# EAGLE design bluz_v2 (EAGLE 7.3.0)
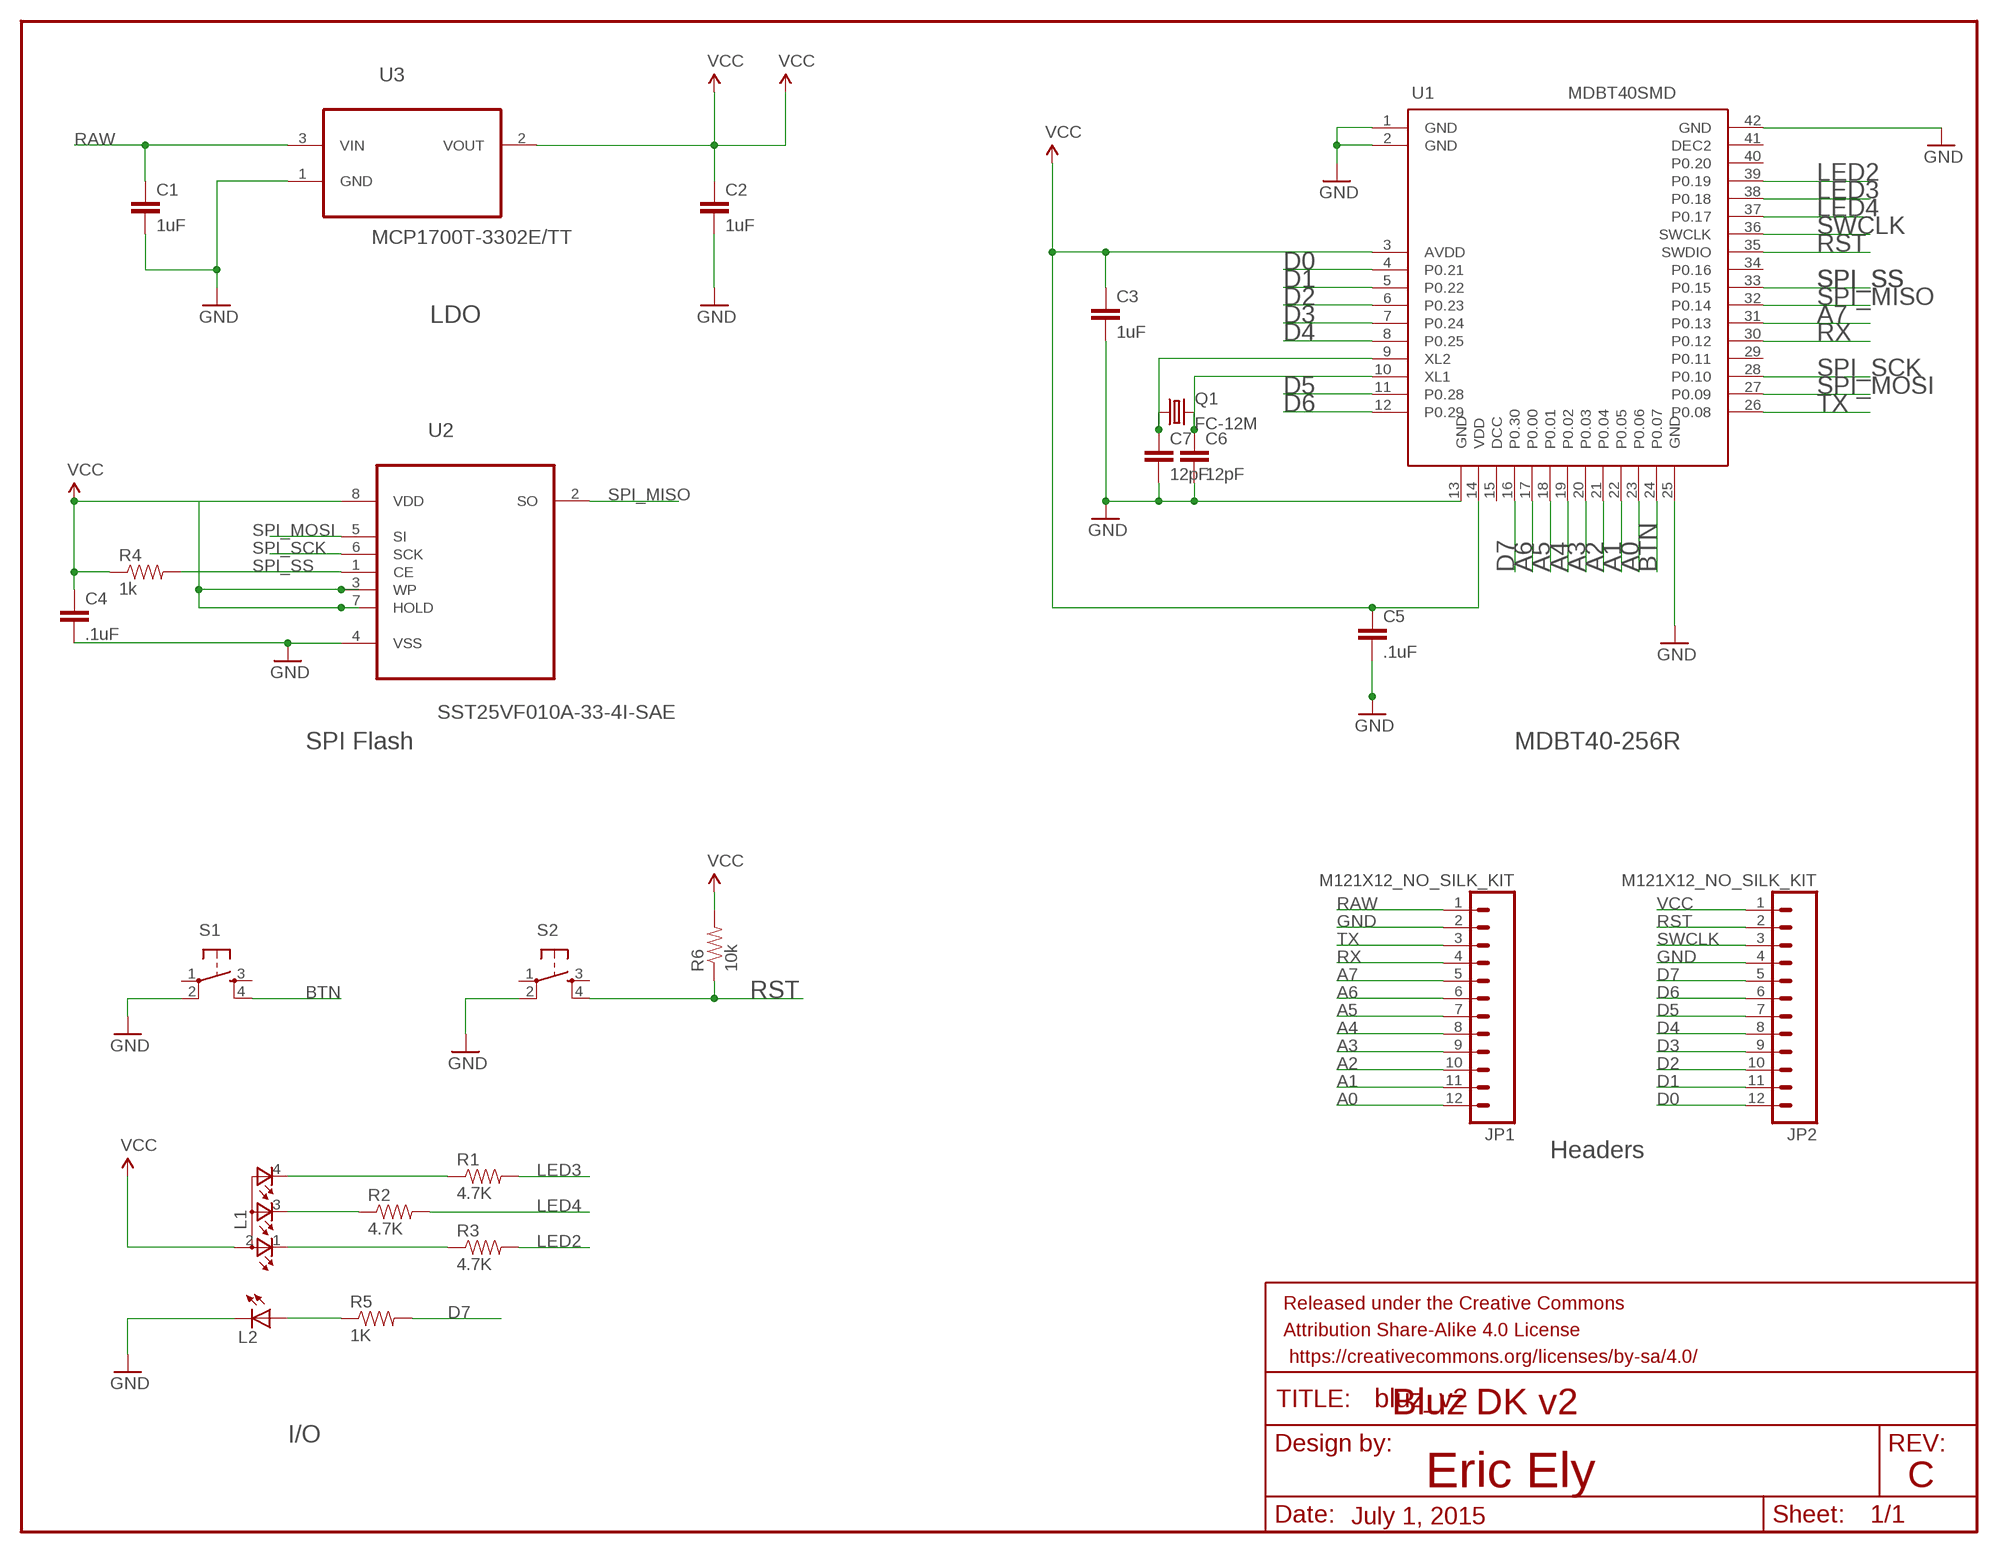
[diagram p0: schematic, sheet 1]

## Parts
C1  1uF  CAP0603-CAP  [0603-CAP]
C2  1uF  CAP0603-CAP  [0603-CAP]
C3  1uF  CAP0603-CAP  [0603-CAP]
C4  .1uF  CAP0603-CAP  [0603-CAP]
C5  .1uF  CAP0603-CAP  [0603-CAP]
C6  12pF  CAP0603-CAP  [0603-CAP]
C7  12pF  CAP0603-CAP  [0603-CAP]
FRAME1  FRAME-LETTER  [CREATIVE_COMMONS]
JP1  M121X12_NO_SILK_KIT  [1X12_NO_SILK_KIT]
JP2  M121X12_NO_SILK_KIT  [1X12_NO_SILK_KIT]
L1  TOPLED-3PLCC  [P-LCC-4-3]
L2  LEDCHIP-LED0603  [CHIP-LED0603]
Q1  FC-12M  [FC-12M]
R1  4.7K  RESISTOR0603-RES  [0603-RES]
R2  4.7K  RESISTOR0603-RES  [0603-RES]
R3  4.7K  RESISTOR0603-RES  [0603-RES]
R4  1k  RESISTOR0603  [0603-RES]
R5  1K  RESISTOR0603-RES  [0603-RES]
R6  10k  RESISTOR0603-RES  [0603-RES]
S1  TAC_SWITCHSMD  [TACTILE_SWITCH_SMD]
S2  TAC_SWITCHSMD  [TACTILE_SWITCH_SMD]
U1  MDBT40SMD  [MDBT40]
U2  SST25VF010A-33-4I-SAE  [SOIC127P600X175-8N]
U3  MCP1700T-3302E/TT  [SOT95P237X112-3N]

## Nets
A0: JP1.12 U1.23(P0.06)
A1: JP1.11 U1.22(P0.05)
A2: JP1.10 U1.21(P0.04)
A3: JP1.9 U1.20(P0.03)
A4: JP1.8 U1.19(P0.02)
A5: JP1.7 U1.18(P0.01)
A6: JP1.6 U1.17(P0.00)
A7: JP1.5 U1.31(P0.13)
BTN: S1.4 U1.24(P0.07)
D0: JP2.12 U1.4(P0.21)
D1: JP2.11 U1.5(P0.22)
D2: JP2.10 U1.6(P0.23)
D3: JP2.9 U1.7(P0.24)
D4: JP2.8 U1.8(P0.25)
D5: JP2.7 U1.11(P0.28)
D6: JP2.6 U1.12(P0.29)
D7: JP2.5 R5.2 U1.16(P0.30)
GND: C1.2 C2.2 C3.2 C4.2 C5.2 C6.2 C7.2 JP1.2 JP2.4 L2.C S1.2 S2.2 U1.1(GND) U1.2(GND) U1.13(GND) U1.25(GND) U1.42(GND) U2.4(VSS) U3.1(GND)
LED2: R3.2 U1.39(P0.19)
LED3: R1.2 U1.38(P0.18)
LED4: R2.2 U1.37(P0.17)
N$2: C7.1 Q1.1 U1.9(XL2)
N$3: C6.1 Q1.2 U1.10(XL1)
N$4: L2.A R5.1
N$5: L1.1(CRED) R3.1
N$6: L1.3(CBLUE) R2.1
N$7: L1.4(CGREEN) R1.1
RAW: C1.1 JP1.1 U3.3(VIN)
RST: JP2.2 R6.1 S2.4 U1.35(SWDIO)
RX: JP1.4 U1.30(P0.12)
SPI_MISO: U1.32(P0.14) U2.2(SO)
SPI_MOSI: U1.27(P0.09) U2.5(SI)
SPI_SCK: U1.28(P0.10) U2.6(SCK)
SPI_SS: R4.2 U1.33(P0.15) U2.1(CE)
SWCLK: JP2.3 U1.36(SWCLK)
TX: JP1.3 U1.26(P0.08)
VCC: C2.1 C3.1 C4.1 C5.1 JP2.1 L1.2(A2) R4.1 R6.2 U1.3(AVDD) U1.14(VDD) U2.3(WP) U2.7(HOLD) U2.8(VDD) U3.2(VOUT)
Unconnected: S1.1 S1.3 S2.1 S2.3 U1.15(DCC) U1.29(P0.11) U1.34(P0.16) U1.40(P0.20) U1.41(DEC2)

## Notes on the sheet
- LDO
- SPI Flash | MDBT40-256R
- Headers
- Bluz DK v2
- I/O
- Eric Ely | C
- July 1, 2015

## Library data of the parts
C1-C7 = SparkFun-Capacitors:CAP: Capacitor Standard 0603 ceramic capacitor, and 0.1" leaded capacitor.
FRAME1 = SparkFun-Aesthetics:FRAME-LETTER: Schematic Frame Standard 8.5x11 US Letter frame
JP1 JP2 = SparkFun-Connectors:M12: Header 12 Standard 12-pin 0.1" header. Use with straight break away headers (SKU : PRT-00116), right angle break away headers (PRT-00553), swiss pins (PRT-00743), machine pins (PRT-00117), and female headers (PRT-00115).
L1 = bluze_libr:TOPLED-3: Cree CLVBA-FKA
L2 = led:LED: LED OSRAM: - CHIPLED LG R971, LG N971, LY N971, LG Q971, LY Q971, LO R971, LY R971 LH N974, LH R974 LS Q976, LO Q976, LY Q976 LO Q996 - Hyper CHIPLED LW Q18S LB Q993, LB Q99A, LB R99A - SideLED LS A670, LO A670, LY A670, LG A670, LP A670 LB A673, LV A673, LT A673, LW A673 LH A674 LY A675 LS A676, LA A676, LO A676, LY A676, LW A676 LS A679, LY A679, LG A679 - Hyper Micro SIDELED® LS Y876, LA Y876, LO Y876, LY Y876 LT Y87S - SmartLED LW L88C, LW L88S LB L89C, LB L89S, LG L890 LS L89K, LO L89K, LY L89K LS L896, LA L896, LO L896, LY L896 - TOPLED LS T670, LO T670, LY T670, LG T670, LP T670 LSG T670, LSP T670, LSY T670, LOP T670, LYG T670 LG T671, LOG T671, LSG T671 LB T673, LV T673, LT T673, LW T673 LH T674 LS T676, LA T676, LO T676, LY T676, LB T676, LH T676, LSB T676, LW T676 LB T67C, LV T67C, LT T67C, LS T67K, LO T67K, LY T67K, LW E67C LS E67B, LA E67B, LO E67B, LY E67B, LB E67C, LV E67C, LT E67C LW T67C LS T679, LY T679, LG T679 LS T770, LO T770, LY T770, LG T770, LP T770 LB T773, LV T773, LT T773, LW T773 LH T774 LS E675, LA E675, LY E675, LS T675 LS T776, LA T776, LO T776, LY T776, LB T776 LHGB T686 LT T68C, LB T68C - Hyper Mini TOPLED® LB M676 - Mini TOPLED Santana® LG M470 LS M47K, LO M47K, LY M47K Source: http://www.osram.convergy.de LUXEON: - LUMILED® LXK2-PW12-R00, LXK2-PW12-S00, LXK2-PW14-U00, LXK2-PW14-V00 LXK2-PM12-R00, LXK2-PM12-S00, LXK2-PM14-U00 LXK2-PE12-Q00, LXK2-PE12-R00, LXK2-PE12-S00, LXK2-PE14-T00, LXK2-PE14-U00 LXK2-PB12-K00, LXK2-PB12-L00, LXK2-PB12-M00, LXK2-PB14-N00, LXK2-PB14-P00, LXK2-PB14-Q00 LXK2-PR12-L00, LXK2-PR12-M00, LXK2-PR14-Q00, LXK2-PR14-R00 LXK2-PD12-Q00, LXK2-PD12-R00, LXK2-PD12-S00 LXK2-PH12-R00, LXK2-PH12-S00 LXK2-PL12-P00, LXK2-PL12-Q00, LXK2-PL12-R00 Source: www.luxeon.com KINGBRIGHT: KA-3528ASYC Source: www.kingbright.com
Q1 = crystal:FC-12M: kHz RANGE CRYSTAL UNIT LOW PROFILE SMD Source: Epson Toyocom FC-12M.pdf
R1-R3 R5 R6 = SparkFun-Passives:RESISTOR: Resistor Basic schematic elements and footprints for 0603, 1206, and PTH resistors.
R4 = SparkFun-Resistors:RESISTOR: Resistor Basic schematic elements and footprints for 0603, 1206, and PTH resistors.
S1 S2 = Spark:TAC_SWITCH: SMD Tactiile Switch
U1 = MDBT40:MDBT40
U2 = Silicon_Storage_Tech_By_element14_Batch_1:SST25VF010A-33-4I-SAE: 1 Mbit SPI Serial Flash; MPN: SST25VF010A-33-4I-SAE; OC_FARNELL: 1368686; OC_NEWARK: 54M1121; PACKAGE: SOIC-8; SUPPLIER: SILICON STORAGE TECHNOLOGY
U3 = Microchip_By_element14_Batch_1:MCP1700T-3302E/TT: Low Quiescent Current LDO; MPN: MCP1700T-3302E/TT; OC_FARNELL: 1296592; OC_NEWARK: 88H9817; PACKAGE: SOT23-3; SUPPLIER: Microchip

## Board
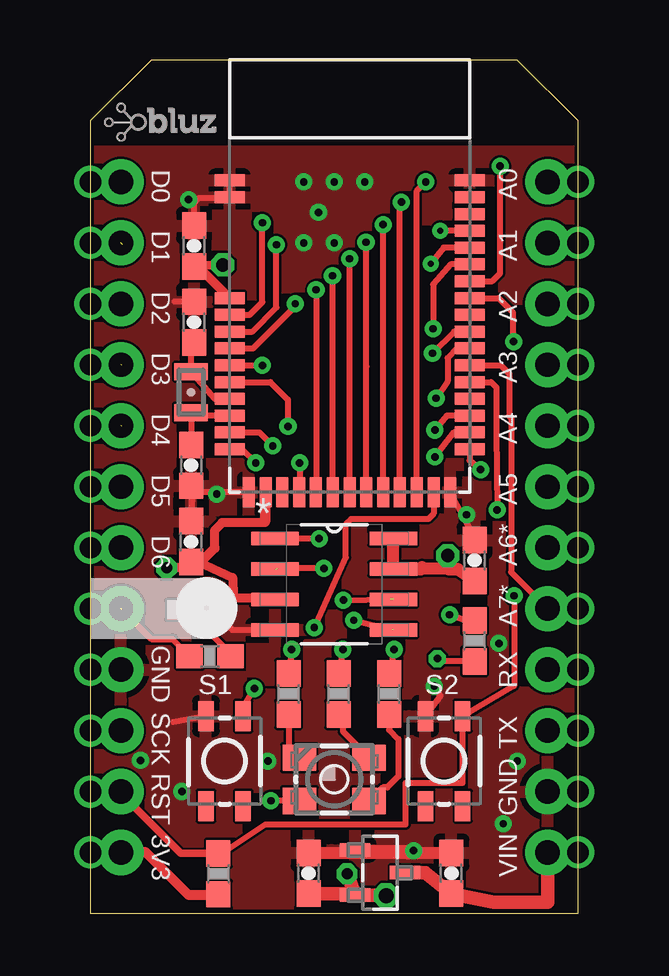
[diagram p1: board, top side]
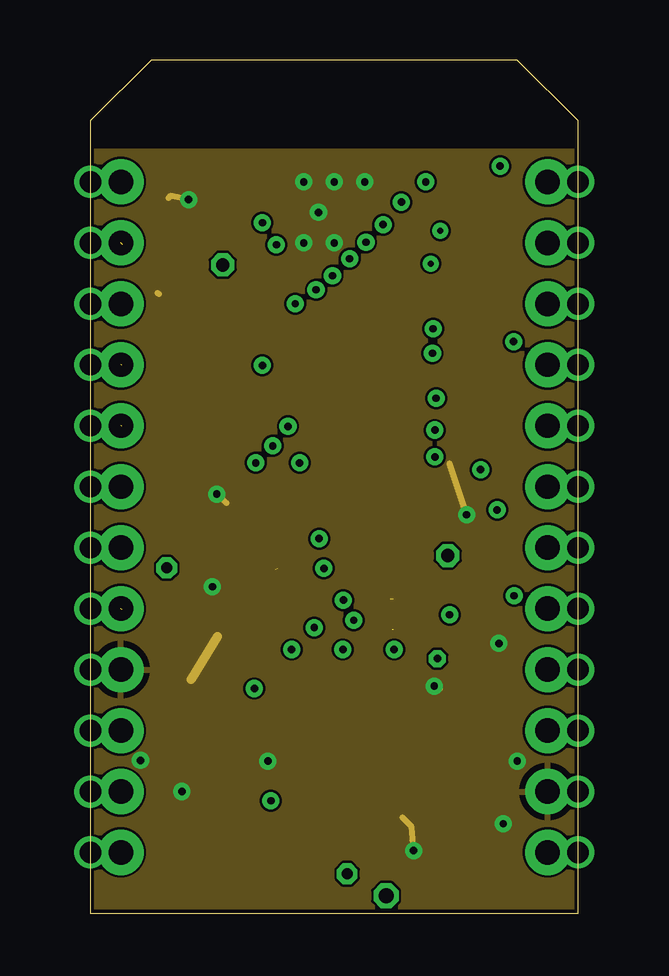
[diagram p2: board, inner layer GND]
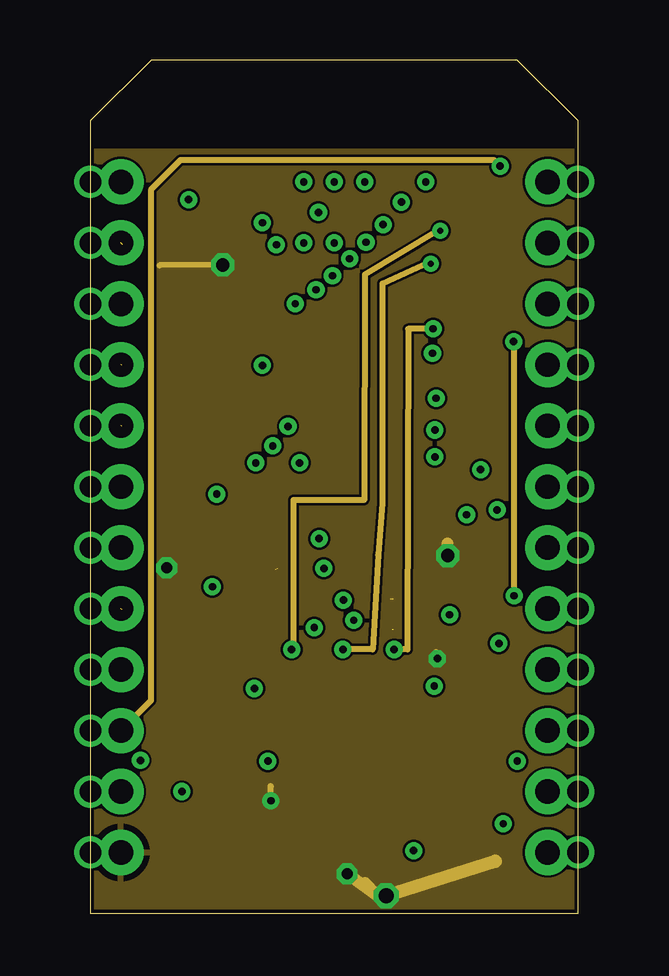
[diagram p3: board, inner layer 3V3]
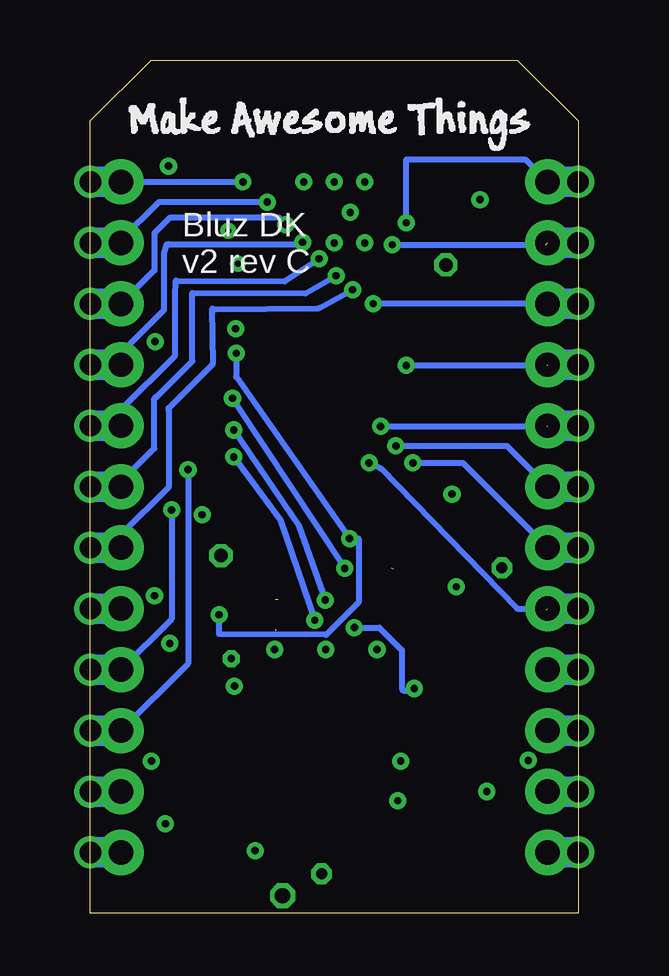
[diagram p4: board, bottom side, seen from below]

Size 20.32 x 35.56 mm. Coordinates in mm from the lower left corner, seen from the top.
Outline: 0,0 20.32,0 20.32,33.02 17.78,35.56 2.54,35.56 0,33.02 0,0
Copper layers (1*16): Top 0.035mm / dielectric 1.5mm / Bottom 0.035mm
Design rules "default *": minimum track width 8mil, minimum drill 8mil, track to track 4mil, track to pad 4mil, pad to pad 4mil, via to via 4mil, smd to smd 4mil, copper to edge 6mil, drill to drill 6mil, minimum pad ring 10mil, minimum via ring 8mil, stop-mask expansion 4mil, vias tented up to drill 26mil, thermal gap 10mil

### Footprints (pad centres in the part's own frame; a part is rotated, then mirrored left to right if it is on the bottom)
0603-CAP = smd 1.1 x 1: 1 -0.85,0; 2 0.85,0
1X12_NO_SILK_KIT = drill 1.016 pad 1.88: 1 0,0; 2 2.54,0; 3 5.08,0; 4 7.62,0; 5 10.16,0; 6 12.7,0; 7 15.24,0; 8 17.78,0; 9 20.32,0; 10 22.86,0; 11 25.4,0; 12 27.94,0
P-LCC-4-3 = smd 1.1 x 1.4: 1 0.9,1.45; 2 -0.9,1.45; 3 -0.9,-1.45; 4 0.9,-1.45
CHIP-LED0603 = smd 0.8 x 0.8: A 0,-0.75; C 0,0.75
FC-12M = smd 0.7 x 1.4: 1 -0.85,0; 2 0.85,0
0603-RES = smd 1.1 x 1: 1 -0.85,0; 2 0.85,0
TACTILE_SWITCH_SMD = smd 1.25 x 0.65: 1 -1.875,0.775; 2 1.875,0.775; 3 -1.875,-0.775; 4 1.875,-0.775
MDBT40 = smd 1.25 x 0.5: 1 0.08,12.89; 2 0.08,12.19; 3 0.08,7.99; 4 0.08,7.29; 5 0.08,6.59; 6 0.08,5.89; 7 0.08,5.19; 8 0.08,4.49; 9 0.08,3.79; 10 0.08,3.09; 11 0.08,2.39; 12 0.08,1.69; 26 10.08,1.69; 27 10.08,2.39; 28 10.08,3.09; 29 10.08,3.79; 30 10.08,4.49; 31 10.08,5.19; 32 10.08,5.89; 33 10.08,6.59; 34 10.08,7.29; 35 10.08,7.99; 36 10.08,8.69; 37 10.08,9.39; 38 10.08,10.09; 39 10.08,10.79; 40 10.08,11.49; 41 10.08,12.19; 42 10.08,12.89 | smd 0.5 x 1.25: 13 0.88,-0.11; 14 1.58,-0.11; 15 2.28,-0.11; 16 2.98,-0.11; 17 3.68,-0.11; 18 4.38,-0.11; 19 5.08,-0.11; 20 5.78,-0.11; 21 6.48,-0.11; 22 7.18,-0.11; 23 7.88,-0.11; 24 8.58,-0.11; 25 9.28,-0.11
SOIC127P600X175-8N = smd 1.981 x 0.559: 1 -2.464,1.905; 2 -2.464,0.635; 3 -2.464,-0.635; 4 -2.464,-1.905; 5 2.464,-1.905; 6 2.464,-0.635; 7 2.464,0.635; 8 2.464,1.905
SOT95P237X112-3N = smd 0.559 x 1.27: 1 -0.94,-1.041; 2 0.94,-1.041; 3 0,1.041

### Placement (x,y rotation side)
C1  15.04,1.68 90 top
C2  9.09,1.68 90 top
C3  4.32,27.81 90 top
C4  16,14.71 90 top
C5  4.19,15.49 90 top
C6  4.19,18.67 270 top
C7  4.32,24.64 90 top
FRAME1  21.59,-12.7 0 top  (outside the outline)
JP1  19.05,2.54 90 top
JP2  1.27,2.54 90 top
L1  10.16,5.59 90 top
L2  4.34,12.65 270 top
Q1  4.19,21.72 270 top
R1  10.34,9.14 90 top
R2  12.45,9.14 90 top
R3  8.26,9.14 90 top
R4  16,11.35 90 top
R5  4.98,10.72 180 top
R6  5.33,1.65 270 top
S1  5.59,6.35 90 top
S2  14.73,6.35 90 top
U1  5.71,17.65 0 top
U2  10.16,13.72 0 top
U3  12.06,1.7 270 top
U$1  [BLUZE_LOGO_LOW_RES]  0.58,32.18 0 top
U$2  [MAKE_X2]  19.05,31.75 0 bottom

### Tracks (layer width: path | path; a pad name or v marks a point on that pad's centre or on a via)
A0  (via drill 0.3, 0.89)
  Top 0.254: U1.23 13.6,30.11 v13.97,30.48
  Bottom 0.254: JP1.12 v13.97,30.48
  Bottom 1.27: JP1.12 v20.32,30.48
A1  (via drill 0.3, 0.89)
  Top 0.254: U1.22 12.89,29.46 v12.95,29.64
  Bottom 0.254: v12.95,29.64 17.48,29.64 19.05,28.07 JP1.11
  Bottom 1.27: JP1.11 v20.32,27.94
A2  (via drill 0.3, 0.89)
  Top 0.254: U1.21 12.2,24.64 v12.19,28.7
  Bottom 0.254: v12.19,28.7 12.47,29.01 16.99,29.01 17.65,28.35 17.65,26.8 JP1.10
  Bottom 1.27: JP1.10 v20.32,25.4
A3  (via drill 0.3, 0.89)
  Top 0.254: U1.20 11.49,22.8 v11.48,27.96
  Bottom 0.254: 11.53,27.91 v11.48,27.96 11.51,27.89 17.07,27.89 17.14,27.86 17.25,27.53 17.25,25.15 19.05,23.34 JP1.9
  Bottom 1.27: JP1.9 v20.32,22.86
A4  (via drill 0.3, 0.89)
  Top 0.254: U1.19 v10.79,27.28
  Bottom 0.254: v10.79,27.28 12.24,26.34 16.76,26.36 16.79,25.73 16.79,23.24 19.05,20.98 JP1.8
  Bottom 1.27: JP1.8 v20.32,20.32
A5  (via drill 0.3, 0.89)
  Top 0.254: v10.08,26.57 10.08,17.55 U1.18
  Bottom 0.254: v10.08,26.57 11.35,25.83 16.08,25.86 16.08,23.01 17.58,21.51 17.6,21.51 17.65,21.46 17.65,19.38 19.05,17.98 JP1.7
  Bottom 1.27: JP1.7 v20.32,17.78
A6  (via drill 0.3, 0.89)
  Top 0.254: 9.37,17.52 U1.17 v9.4,25.98
  Bottom 0.254: v9.4,25.98 10.79,25.22 15.14,25.17 15.24,25.2 15.21,22.91 17.07,21.06 17.07,20.95 17.04,20.93 17.04,17.78 19.05,15.77 JP1.6
  Bottom 1.27: JP1.6 v20.32,15.24
A7  (via drill 0.89)
  Top 0.254: U1.31 17.09,22.84 17.45,22.48 17.45,20.76 17.43,20.74 17.53,20.65 17.53,14.22 JP1.5
  Bottom 1.27: JP1.5 v20.32,12.7
BTN  (via drill 0.3)
  Top 0.254: U1.24 14.29,16.66 14.07,16.43 10.85,16.43 10.64,16.23 10.64,14.83 v9.32,11.91 | v6.83,9.37 6.14,8.26 S1.4
  Bottom 0.254: v9.32,11.91 8.28,11.91 7.34,10.97 7.34,9.35 7.26,9.27 6.88,9.27 v6.83,9.37
D0  (via drill 0.3, 0.89)
  Top 0.254: U1.4 6.63,24.94 7.16,25.48 v7.16,28.78
  Bottom 0.254: v7.16,28.78 7.16,31.42 2.21,31.42 JP2.12
  Bottom 1.27: v0,30.48 JP2.12
D1  (via drill 0.3, 0.89)  (1 unrouted)
  Top 0.254: U1.5 6.74,24.24 7.75,25.25 v7.75,27.86
  Bottom 0.254: v7.75,27.86 1.35,27.86
  Bottom 1.27: v0,27.94 JP2.11
D2  (via drill 0.3, 0.89)
  Top 0.254: U1.6 6.78,23.54 8.53,25.3 v8.53,25.4
  Bottom 0.254: JP2.10 v8.53,25.4
  Bottom 1.27: v0,25.4 JP2.10
D3  (via drill 0.3, 0.89)  (1 unrouted)
  Top 0.254: U1.7 7.15,22.84 v7.16,22.84
  Bottom 0.254: v7.16,22.84 1.29,22.84
  Bottom 1.27: v0,22.86 JP2.9
D4  (via drill 0.3, 0.89)  (1 unrouted)
  Top 0.254: U1.8 7.5,22.14 8.23,21.41 v8.23,20.3
  Bottom 0.254: v8.23,20.3 1.29,20.3
  Bottom 1.27: v0,20.32 JP2.8
D5  (via drill 0.3, 0.89)
  Top 0.254: U1.11 7.03,20.04 v7.59,19.48
  Bottom 0.254: v7.59,19.48 2.97,19.48 JP2.7
  Bottom 1.27: v0,17.78 JP2.7
D6  (via drill 0.3, 0.89)
  Top 0.254: U1.12 6.31,19.34 v6.88,18.77
  Bottom 0.254: v6.88,18.77 4.8,18.77 JP2.6
  Bottom 1.27: v0,15.24 JP2.6
D7  (via drill 0.3, 0.89)  (1 unrouted)
  Top 0.254: v8.71,18.77 8.71,17.56 U1.16 | 1.32,12.65 1.37,12.65 1.42,12.7 1.42,12.55 2.54,11.43 3.42,11.43 R5.2
  Bottom 0.254: v8.71,18.77 8.23,18.54 2.54,12.7 JP2.5
  Bottom 1.27: v0,12.7 JP2.5
GND  (via drill 0.3, 0.89)
  Top 0.254: U1.1 U1.2 5.77,29.82 4.52,29.82 4.32,29.62 C3.2 4.32,29.72 v4.09,29.74 | 4.24,17.2 4.24,16.34 C5.2 C6.2 4.19,17.54 U1.13 5.33,17.54 v5.26,17.48 | C7.2 3.49,25.49 | S2.2 14.59,9.08 v14.33,9.47 | L2.C 4.95,12.62 5.92,11.81 U2.4 | S1.2 3.46,7.97 | C4.2 15.54,16.51 U1.25
  Top 0.508: C2.2 C1.2 13.22,2.5 U3.1 v13.46,2.62
  GND 0.254: v4.09,29.74 3.33,29.9 3.25,29.82 | v5.26,17.48 5.66,17.09 | 2.85,25.81 2.79,25.86 | v14.33,9.47 14.55,9.37 14.48,9.45 | v15.67,16.61 14.96,18.75 | v13.46,2.62 13.39,3.61 13.01,3.99
  GND 0.381: 5.28,11.53 4.19,9.75
  Bottom 1.27: v0,10.16 JP2.4 | JP1.2 v20.32,5.08
  other vias: 9.5,29.21 8.89,30.48 10.16,30.48 11.43,30.48 8.89,27.94 10.16,27.94 3.81,5.08 17.2,3.73 17.78,6.35 7.39,6.35 2.08,6.38 17.02,11.25 5.08,13.61
  pour GND: 0,0 0,31.75 20.32,31.75 20.32,0
  pour Top: 0,31.75 20.32,31.75 20.32,0 0,0
LED2  (via drill 0.25, 0.3)
  Top 0.254: U1.39 v14.59,28.44 v14.58,28.45 | v8.38,11 R3.2
  3V3 0.254: v14.58,28.45 14.48,28.45 11.43,26.62 11.4,17.22 8.46,17.22 8.46,11.1 v8.38,11
LED3  (via drill 0.25, 0.3)
  Top 0.254: U1.38 14.71,27.74 v14.17,27.08 | v10.52,11 R1.2
  3V3 0.254: v14.17,27.08 14.12,27.13 12.17,26.24 12.17,17.09 11.99,14.94 11.76,11 v10.52,11
LED4  (via drill 0.3)
  Top 0.254: U1.37 15,27.04 14.28,26.21 v14.28,24.36 | v12.65,11 R2.2
  3V3 0.254: v14.28,24.36 13.23,24.36 13.21,11 v12.65,11
N$2
  Top 0.254: U1.9 5.19,21.44 Q1.1 4.19,23.66 C7.1
N$3
  Top 0.254: U1.10 4.32,20.74 Q1.2 C6.1
N$4
  Top 0.254: R5.1 5.83,10.83 4.9,11.76 4.48,11.76 L2.A
N$5
  Top 0.254: R3.1 8.26,6.94 L1.1
N$6
  Top 0.254: R2.1 12.45,7.64 12.83,7.26 12.83,5.71 12.37,5.26 12.18,5.26 L1.3
N$7
  Top 0.254: R1.1 10.52,8.09 10.52,7.58 L1.4
RAW  (via drill 0.89)
  Top 0.559: U3.3 13.96,1.7 C1.1 16.8,0.46 19.05,0.46 JP1.1
  Bottom 1.27: JP1.1 v20.32,2.54
RST  (via drill 0.3, 0.89)
  Top 0.254: R6.1 5.47,2.5 7.29,3.71 13.13,3.71 13.13,5.44 15.51,5.44 S2.4 17.65,9.48 v17.65,13.23 | U1.35 17,25.64 17.6,25.04 17.6,23.85 v17.63,23.82 | 1.27,5 JP2.2
  Top 0.305: 1.27,5 3.76,2.52 5.32,2.52 R6.1
  3V3 0.254: v17.63,23.82 17.63,13.28 v17.65,13.23
  Bottom 1.27: v0,5.08 JP2.2
RX  (via drill 0.3, 0.89)
  Top 0.254: v16.94,16.82 16.91,20.04 16.92,20.05 16.92,21.92 16.69,22.14 U1.30
  Bottom 0.254: v16.94,16.82 16.94,12.27 JP1.4
  Bottom 1.27: JP1.4 v20.32,10.16
SPI_MISO  (via drill 0.3)  (1 unrouted)
  Top 0.254: U1.32 15.29,23.54 14.88,23.14 14.88,22.17 v14.4,21.46 | v9.73,14.38 7.8,14.38
  Bottom 0.254: v14.4,21.46 14.28,21.23 v9.73,14.38
SPI_MOSI  (via drill 0.3)  (1 unrouted)
  Top 0.254: U1.27 15.14,20.04 v14.35,19.02 | v10.97,12.22 12.57,11.81
  Bottom 0.254: v14.35,19.02 12.42,16.41 v10.97,12.22
SPI_SCK  (via drill 0.3)  (1 unrouted)
  Top 0.254: U1.28 14.85,20.74 v14.35,20.14 | v10.54,13.06 12.5,13.08
  Bottom 0.254: v14.35,20.14 11.63,16.15 v10.54,13.06
SPI_SS  (via drill 0.3)
  Top 0.254: U1.33 15.15,24.24 v14.25,23.34 | R4.2 15.63,12.2 v14.96,12.45 | v9.53,15.62 U2.1
  Bottom 0.254: v14.25,23.34 14.25,22.35 v9.53,15.62 9.14,15.62 9.14,12.96 10.49,11.61 | 10.52,11.61 10.49,11.61 | 10.49,11.61 14.96,11.63 v14.96,12.45
SWCLK  (via drill 0.3, 0.89)
  Top 0.254: U1.36 16.74,26.34 17.07,26.67 v17.07,31.14
  3V3 0.254: v17.07,31.14 16.82,31.39 3.76,31.39 2.52,30.15 2.52,8.87 JP2.3
  Bottom 1.27: v0,7.62 JP2.3
TX  (via drill 0.3, 0.89)
  Top 0.254: U1.26 15.79,18.88 v16.26,18.49
  Bottom 0.254: v16.26,18.49 16.26,10.41 JP1.3
  Bottom 1.27: JP1.3 v20.32,7.62
VCC  (via drill 0.3, 0.46, 0.56, 0.64, 0.89)
  Top 0.254: C3.1 4.47,26.96 | 4.48,14.64 4.59,14.64 | 7.26,17.51 U1.14 | U1.3 5.73,25.64 4.37,27 | R4.1 14.45,10.5 v14.45,10.62 | L1.2 7.53,4.69 v7.52,4.7
  Top 0.381: 4.47,26.96 U1.3 | 4.59,14.64 5.18,15.24 | 5.18,15.24 5.18,15.98 5.49,16.28 7.26,16.28 | 7.26,16.28 7.26,17.51 | C5.1 4.48,14.64 5.92,13.99 5.94,13.21 5.97,13.16 7.7,13.16 U2.3 | 4.37,27 v5.51,27.03 | U1.14 7.29,16.31 7.26,16.28 | 5.18,15.24 5.18,15.21 4.37,14.4 v3.17,14.4
  Top 0.406: R6.2 5.33,0.79 4.06,0.79 2.31,2.54 JP2.1
  Top 0.508: 14.88,14.35 15.3,14.35 C4.1 | 14.88,14.35 14.86,14.38 13.87,14.38 13.82,14.43 13.82,14.35 U2.7 U2.8 | 14.88,14.35 v14.88,14.91
  Top 0.559: U3.2 v10.69,1.65 | U3.2 12.39,0.76 | C2.1 10.96,0.83 U3.2
  3V3 0.254: v5.51,27.03 2.87,27 | v14.45,10.62 14.4,10.62 14.4,10.9 | v7.52,4.7 7.52,5.28 7.49,5.31
  3V3 0.508: v10.69,1.65 11.91,0.79 11.43,1.27 | v14.88,14.91 14.88,15.42
  3V3 0.559: v12.32,0.74 16.87,2.18
  Bottom 1.27: v0,2.54 JP2.1
  pour 3V3: 0,0 0,31.75 20.29,31.75 20.32,0

### Text on the board
tPlace: D0 | A0 | D1 | A1 | D2 | A2 | D3 | A3 | D4 | A4 | D5 | A5 | D6 | A6* | A7* | GND | RX | SCK | TX | RST | GND | 3V3 | VIN | /Users/eely/Dropbox/fun/sparkle/graphics/logo/logo.bmp
bPlace: Bluz DK / v2 rev C
tStop: D7